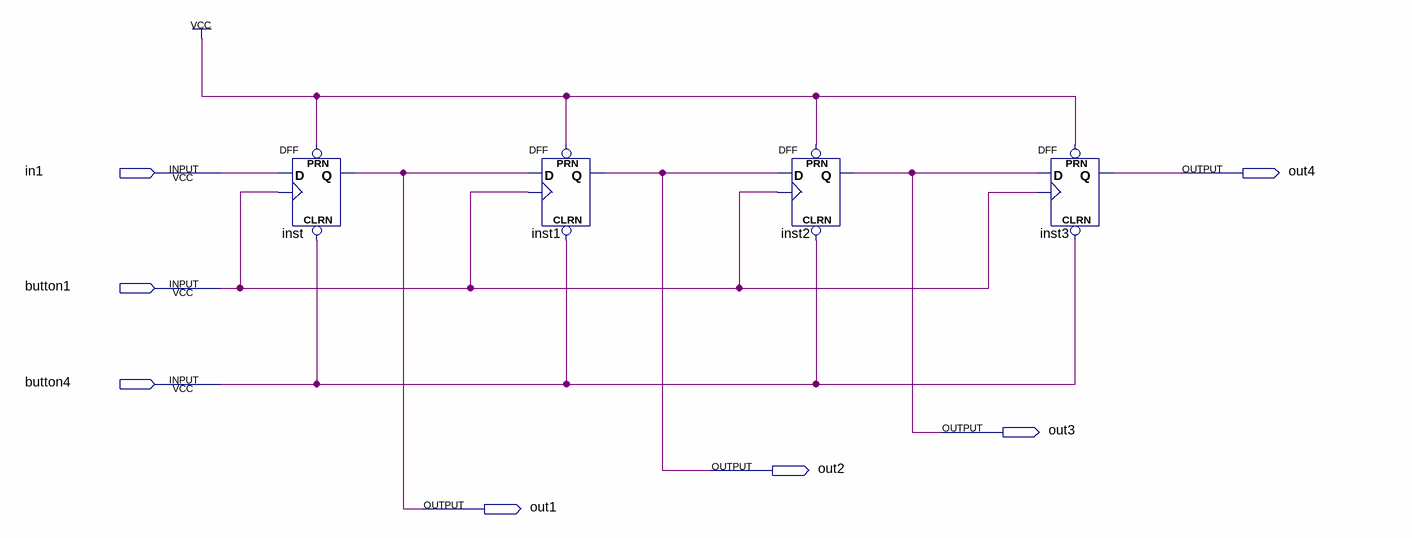
[diagram p0: schematic sheet]
// Quartus schematic ShiftRegisterSIPO_4bit.bdf as structural Verilog: 4 symbols, 7 pins
module ShiftRegisterSIPO_4bit (
  input  in1,
  input  button1,
  input  button4,
  output out4,
  output out3,
  output out2,
  output out1
);

  DFF inst (.CLRN(button4), .CLK(button1), .D(in1), .PRN(1'b1), .Q(out1));
  DFF inst1 (.CLRN(button4), .CLK(button1), .D(out1), .PRN(1'b1), .Q(out2));
  DFF inst2 (.CLRN(button4), .CLK(button1), .D(out2), .PRN(1'b1), .Q(out3));
  DFF inst3 (.CLRN(button4), .CLK(button1), .D(out3), .PRN(1'b1), .Q(out4));
endmodule
